# EAGLE design Roaster Breakout (EAGLE 9.6.2)
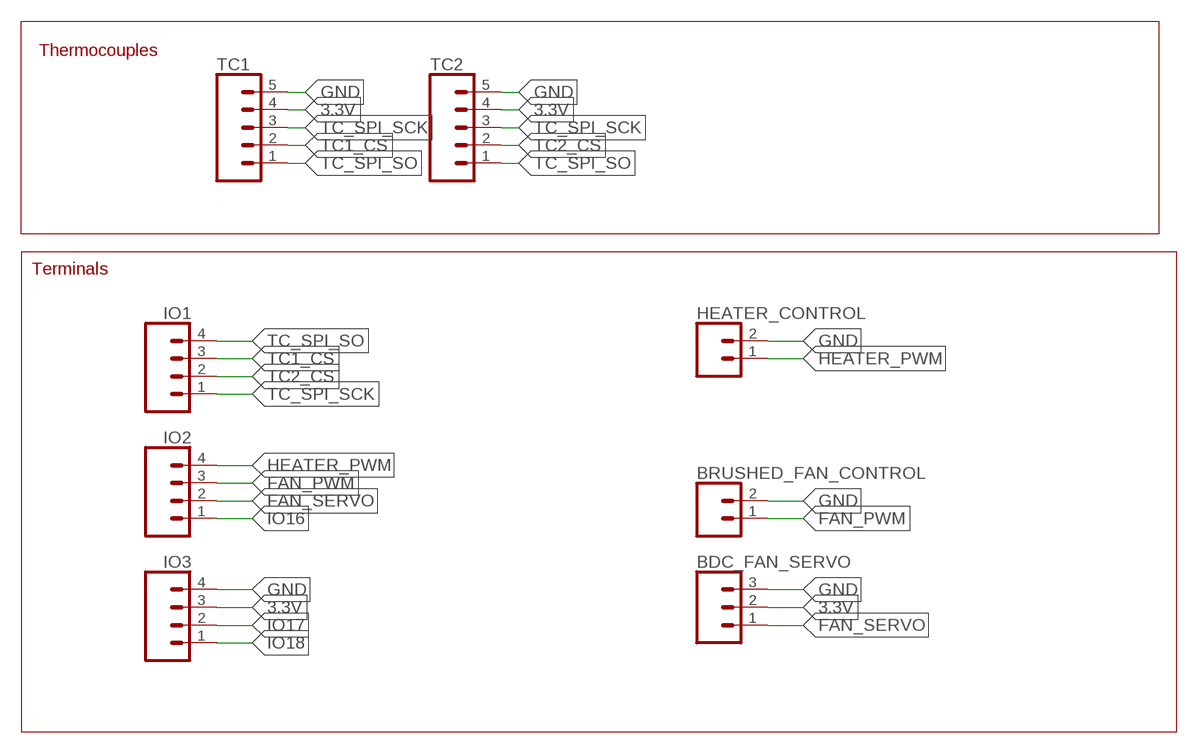
[diagram p0: schematic, sheet 1]

## Parts
BDC_FAN_SERVO  CONN_03LONGPADS  [1X03_LONGPADS]
BRUSHED_FAN_CONTROL  CONN_02PTH3  [1X02_LONGPADS]
HEATER_CONTROL  CONN_02PTH3  [1X02_LONGPADS]
IO1  CONN_04LONGPADS  [1X04_LONGPADS]
IO2  CONN_04LONGPADS  [1X04_LONGPADS]
IO3  CONN_04LONGPADS  [1X04_LONGPADS]
TC1  CONN_05PTH_LONGPADS  [1X05_LONGPADS]
TC2  CONN_05PTH_LONGPADS  [1X05_LONGPADS]

## Nets
3.3V: BDC_FAN_SERVO.2 IO3.3 TC1.4 TC2.4
FAN_PWM: BRUSHED_FAN_CONTROL.1 IO2.3
FAN_SERVO: BDC_FAN_SERVO.1 IO2.2
GND [current]: BDC_FAN_SERVO.3 BRUSHED_FAN_CONTROL.2 HEATER_CONTROL.2 IO3.4 TC1.5 TC2.5
HEATER_PWM: HEATER_CONTROL.1 IO2.4
IO16: IO2.1
IO17: IO3.2
IO18: IO3.1
TC1_CS: IO1.3 TC1.2
TC2_CS: IO1.2 TC2.2
TC_SPI_SCK: IO1.1 TC1.3 TC2.3
TC_SPI_SO: IO1.4 TC1.1 TC2.1

## Notes on the sheet
- Thermocouples
- Terminals

## Library data of the parts
BDC_FAN_SERVO = SparkFun-Connectors:CONN_03: Multi connection point. Often used as Generic Header-pin footprint for 0.1 inch spaced/style header connections On any of the 0.1 inch spaced packages, you can populate with these: Break Away Headers - Straight <https://www.sparkfun.com/products/116> (PRT-00116) Break Away Male Headers - Right Angle <https://www.sparkfun.com/products/553> (PRT-00553) Female Headers <https://www.sparkfun.com/products/115> (PRT-00115) Break Away Headers - Machine Pin <https://www.sparkfun.com/products/117> (PRT-00117) Break Away Female Headers - Swiss Machine Pin <https://www.sparkfun.com/products/743> (PRT-00743) Stackable Header - 3 Pin (Female, 0.1") <https://www.sparkfun.com/products/13875> (PRT-13875) For SCREWTERMINALS and SPRING TERMINALS visit here: Screw Terimnals on SparkFun.com <https://www.sparkfun.com/search/results?term=Screw+Terminals> (5mm/3.5mm/2.54mm spacing) This device is also useful as a general connection point to wire up your design to another part of your project. Our various solder wires solder well into these plated through hole pads. Hook-Up Wire - Assortment (Stranded, 22 AWG) <https://www.sparkfun.com/products/11375> (PRT-11375) Hook-Up Wire - Assortment (Solid Core, 22 AWG) <https://www.sparkfun.com/products/11367> (PRT-11367) View the entire wire category on our website here <https://www.sparkfun.com/categories/141> Special notes: Molex polarized connector foot print use with SKU : PRT-08232 with associated crimp pins and housings.
BRUSHED_FAN_CONTROL HEATER_CONTROL = SparkFun-Connectors:CONN_02: Multi connection point. Often used as Generic Header-pin footprint for 0.1 inch spaced/style header connections On any of the 0.1 inch spaced packages, you can populate with these: Break Away Headers - Straight <https://www.sparkfun.com/products/116> (PRT-00116) Break Away Male Headers - Right Angle <https://www.sparkfun.com/products/553> (PRT-00553) Female Headers <https://www.sparkfun.com/products/115> (PRT-00115) Break Away Headers - Machine Pin <https://www.sparkfun.com/products/117> (PRT-00117) Break Away Female Headers - Swiss Machine Pin <https://www.sparkfun.com/products/743> (PRT-00743) For SCREWTERMINALS and SPRING TERMINALS visit here: Screw Terimnals on SparkFun.com <https://www.sparkfun.com/search/results?term=Screw+Terminals> (5mm/3.5mm/2.54mm spacing) This device is also useful as a general connection point to wire up your design to another part of your project. Our various solder wires solder well into these plated through hole pads. Hook-Up Wire - Assortment (Stranded, 22 AWG) <https://www.sparkfun.com/products/11375> (PRT-11375) Hook-Up Wire - Assortment (Solid Core, 22 AWG) <https://www.sparkfun.com/products/11367> (PRT-11367) View the entire wire category on our website here <https://www.sparkfun.com/categories/141> Special notes: Molex polarized connector foot print use with: PRT-08233 with associated crimp pins and housings. 2.54_SCREWTERM for use with PRT-10571. 3.5mm Screw Terminal footprints for PRT-08084 5mm Screw Terminal footprints for use with PRT-08432
IO1-IO3 = SparkFun-Connectors:CONN_04: Multi connection point. Often used as Generic Header-pin footprint for 0.1 inch spaced/style header connections On any of the 0.1 inch spaced packages, you can populate with these: Break Away Headers - Straight <https://www.sparkfun.com/products/116> (PRT-00116) Break Away Male Headers - Right Angle <https://www.sparkfun.com/products/553> (PRT-00553) Female Headers <https://www.sparkfun.com/products/115> (PRT-00115) Break Away Headers - Machine Pin <https://www.sparkfun.com/products/117> (PRT-00117) Break Away Female Headers - Swiss Machine Pin <https://www.sparkfun.com/products/743> (PRT-00743) For SCREWTERMINALS and SPRING TERMINALS visit here: Screw Terimnals on SparkFun.com <https://www.sparkfun.com/search/results?term=Screw+Terminals> (5mm/3.5mm/2.54mm spacing) This device is also useful as a general connection point to wire up your design to another part of your project. Our various solder wires solder well into these plated through hole pads. Hook-Up Wire - Assortment (Stranded, 22 AWG) <https://www.sparkfun.com/products/11375> (PRT-11375) Hook-Up Wire - Assortment (Solid Core, 22 AWG) <https://www.sparkfun.com/products/11367> (PRT-11367) View the entire wire category on our website here <https://www.sparkfun.com/categories/141> Special notes: Molex polarized connector foot print use with SKU : PRT-08231 with associated crimp pins and housings. 1MM SMD Version SKU: PRT-10208; PROD_ID: CONN-09696
TC1 TC2 = SparkFun-Connectors:CONN_05: Multi connection point. Often used as Generic Header-pin footprint for 0.1 inch spaced/style header connections On any of the 0.1 inch spaced packages, you can populate with these: Break Away Headers - Straight <https://www.sparkfun.com/products/116> (PRT-00116) Break Away Male Headers - Right Angle <https://www.sparkfun.com/products/553> (PRT-00553) Female Headers <https://www.sparkfun.com/products/115> (PRT-00115) Break Away Headers - Machine Pin <https://www.sparkfun.com/products/117> (PRT-00117) Break Away Female Headers - Swiss Machine Pin <https://www.sparkfun.com/products/743> (PRT-00743) For SCREWTERMINALS and SPRING TERMINALS visit here: Screw Terimnals on SparkFun.com <https://www.sparkfun.com/search/results?term=Screw+Terminals> (5mm/3.5mm/2.54mm spacing) This device is also useful as a general connection point to wire up your design to another part of your project. Our various solder wires solder well into these plated through hole pads. Hook-Up Wire - Assortment (Stranded, 22 AWG) <https://www.sparkfun.com/products/11375> (PRT-11375) Hook-Up Wire - Assortment (Solid Core, 22 AWG) <https://www.sparkfun.com/products/11367> (PRT-11367) View the entire wire category on our website here <https://www.sparkfun.com/categories/141> Special notes: Molex polarized connector foot print use with SKU : PRT-08231 with associated crimp pins and housings. 1MM SMD Version SKU: PRT-10208

## Net classes
0 default: width 0.305 mm, clearance 0.152 mm
1 POWER: width 0.406 mm
2 current: width 0.61 mm, clearance 0.61 mm

## Board
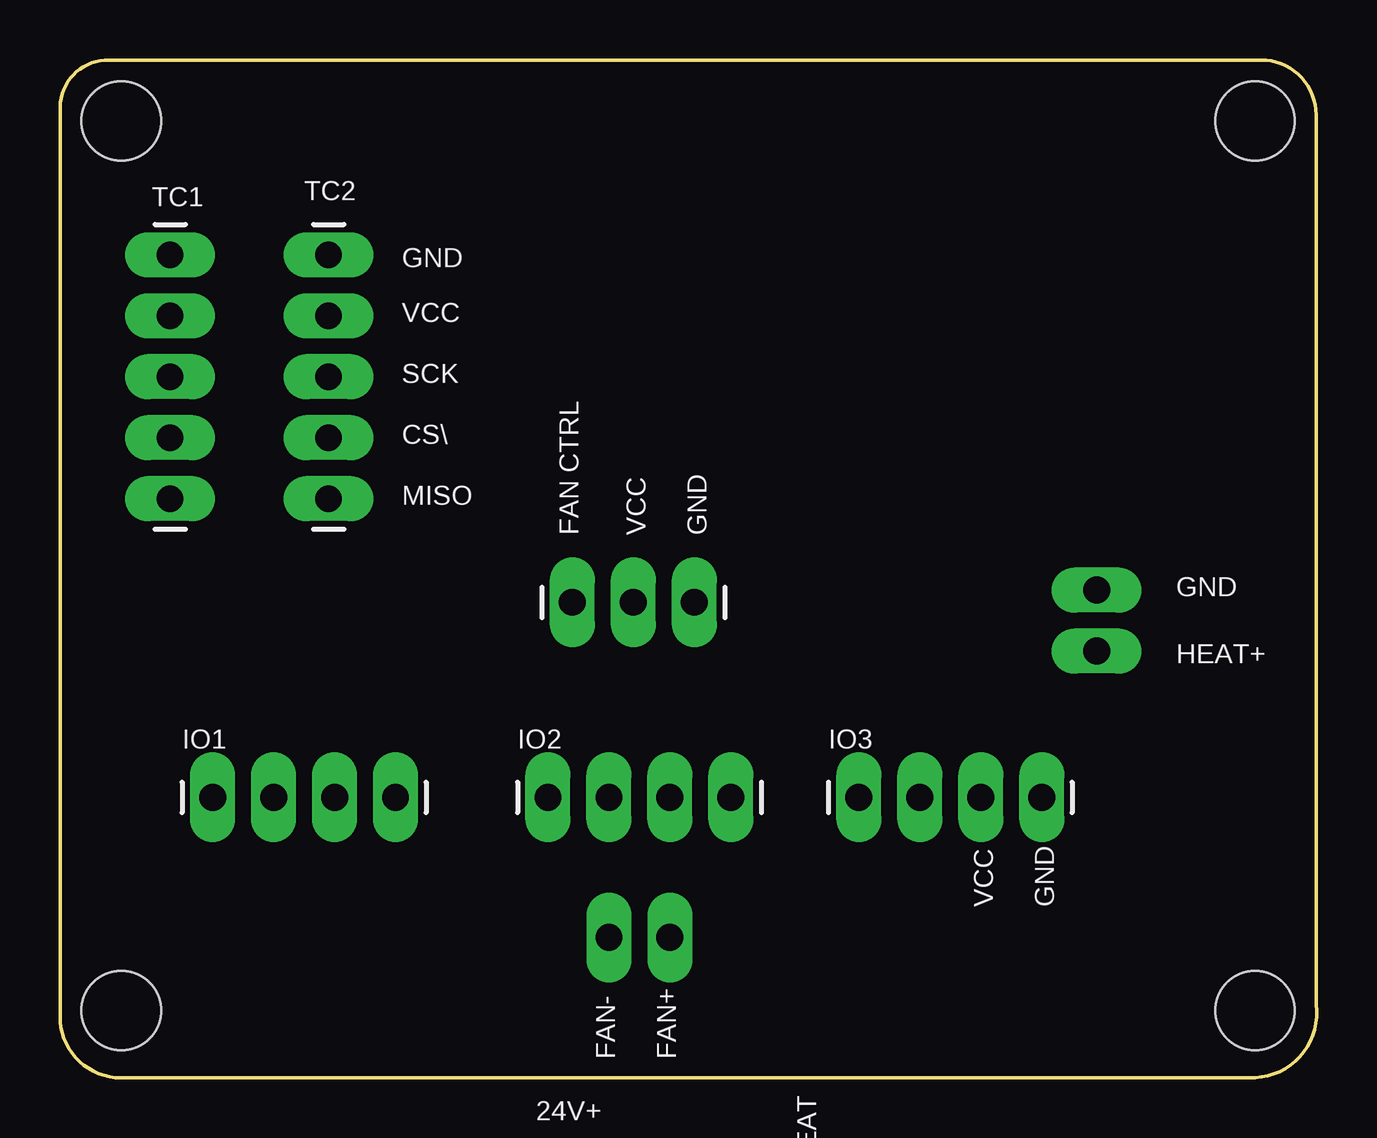
[diagram p1: board, top side]
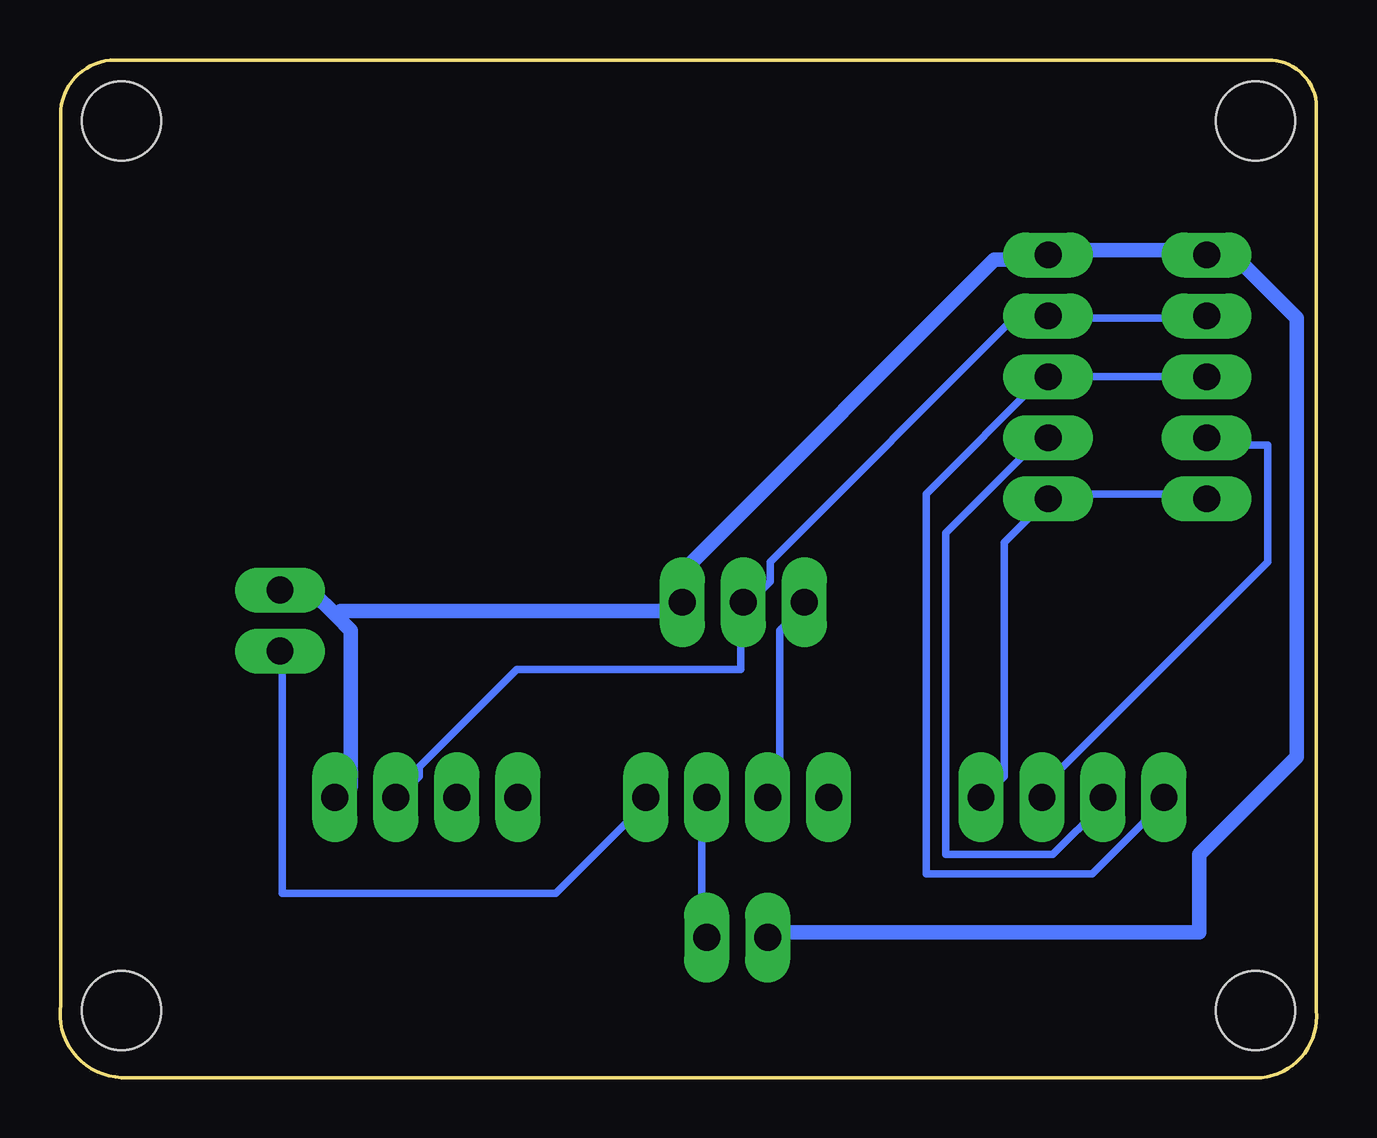
[diagram p2: board, bottom side, seen from below]

Size 52.36 x 42.42 mm. Coordinates in mm from the lower left corner, seen from the top.
Outline: 0.01,2.79 0.01,40.64 arc-84 2.04,42.42 50.05,42.42 arc-90 52.34,40.13 52.34,3.05 arc-101 49.54,0 2.3,0 arc-90 0.01,2.79
Copper layers (1*16): Top 0.0356mm / dielectric 1.5011mm / Bottom 0.0356mm
Design rules "default": minimum track width 6mil, minimum drill 13mil, track to track 6mil, track to pad 6mil, pad to pad 6mil, via to via 6mil, smd to smd 6mil, copper to edge 15mil, drill to drill 6mil, minimum pad ring 7mil, minimum via ring 7mil, stop-mask expansion 3mil, vias tented up to drill 0mil, thermal gap 10mil
Holes 3.3 mm at 2.55,2.79 49.8,2.79 49.8,39.88 2.55,39.88

### Footprints (pad centres in the part's own frame; a part is rotated, then mirrored left to right if it is on the bottom)
1X03_LONGPADS = drill 1.118 pad 1.88 long: 1 0,0; 2 2.54,0; 3 5.08,0
1X02_LONGPADS = drill 1.118 pad 1.88 long: 1 0,0; 2 2.54,0
1X04_LONGPADS = drill 1.118 pad 1.88 long: 1 0,0; 2 2.54,0; 3 5.08,0; 4 7.62,0
1X05_LONGPADS = drill 1.118 pad 1.88 long: 1 0,0; 2 2.54,0; 3 5.08,0; 4 7.62,0; 5 10.16,0

### Placement (x,y rotation side)
BDC_FAN_SERVO  21.35,19.81 0 top
BRUSHED_FAN_CONTROL  25.41,5.84 180 top
HEATER_CONTROL  43.19,17.78 90 top
IO1  6.36,11.68 0 top
IO2  20.33,11.68 0 top
IO3  33.29,11.68 0 top
TC1  4.58,24.13 90 top
TC2  11.19,24.13 90 top
U$1  [LOGO]  59.33,-16.81 0 top  (outside the outline)

### Tracks (layer width: path | path; a pad name or v marks a point on that pad's centre or on a via)
3.3V
  Bottom 0.305: TC1.4 4.89,31.65 10.99,31.65 TC2.4 11.39,31.65 12.61,31.65 22.77,21.49 22.77,20.68 23.58,19.86 BDC_FAN_SERVO.2 23.99,19.46 23.99,17.02 33.34,17.02 37.4,12.95 37.4,12.55 38.21,11.74 IO3.3
FAN_PWM
  Bottom 0.305: BRUSHED_FAN_CONTROL.1 25.62,6.05 25.62,11.33 IO2.3
FAN_SERVO
  Bottom 0.305: BDC_FAN_SERVO.1 21.55,19.46 22.36,18.64 22.36,12.14 22.77,11.74 IO2.2
GND
  Bottom 0.61: 40.86,19.25 41.87,20.27 43.09,20.27 HEATER_CONTROL.2 | 40.86,19.25 40.25,18.64 40.25,12.14 40.65,11.74 IO3.4 | 40.86,19.25 40.65,19.46 26.43,19.46 BDC_FAN_SERVO.3 26.43,19.86 26.02,20.27 26.02,21.49 13.42,34.09 11.39,34.09 TC2.5 10.99,34.49 4.89,34.49 TC1.5 4.48,34.09 3.26,34.09 0.83,31.65 0.83,13.36 4.89,9.3 4.89,6.05 22.77,6.05 BRUSHED_FAN_CONTROL.2
HEATER_PWM
  Bottom 0.305: IO2.4 28.05,11.33 31.71,7.67 43.09,7.67 43.09,17.42 HEATER_CONTROL.1
TC1_CS
  Bottom 0.305: TC1.2 4.48,26.37 2.04,26.37 2.04,21.49 11.39,12.14 11.39,11.74 IO1.3
TC2_CS
  Bottom 0.305: IO1.2 8.95,11.33 10.99,9.3 15.46,9.3 15.46,22.71 11.39,26.77 TC2.2
TC_SPI_SCK
  Bottom 0.305: IO1.1 6.51,11.33 9.36,8.48 16.27,8.48 16.27,24.33 11.39,29.21 TC2.3 TC1.3
TC_SPI_SO
  Bottom 0.305: TC1.1 4.89,24.33 10.99,24.33 TC2.1 13.02,22.3 13.02,12.55 13.83,11.74 IO1.4

### Text on the board
tNames: GND | VCC | SCK | CS\ | MISO | FAN CTRL | VCC | GND | GND | HEAT+ | VCC | GND | FAN- | FAN+ | 24V+ | HEAT | TC1 | FAN | TC2 | GND | VCC | SCK | PUSHB | QUAD1 | QUAD2 | GND | SCL | SDA | VCC | GND | CS\ | MISO | GND | RX | TX | VCC